# Altium project SolarTracker_ESP32.PrjPcb
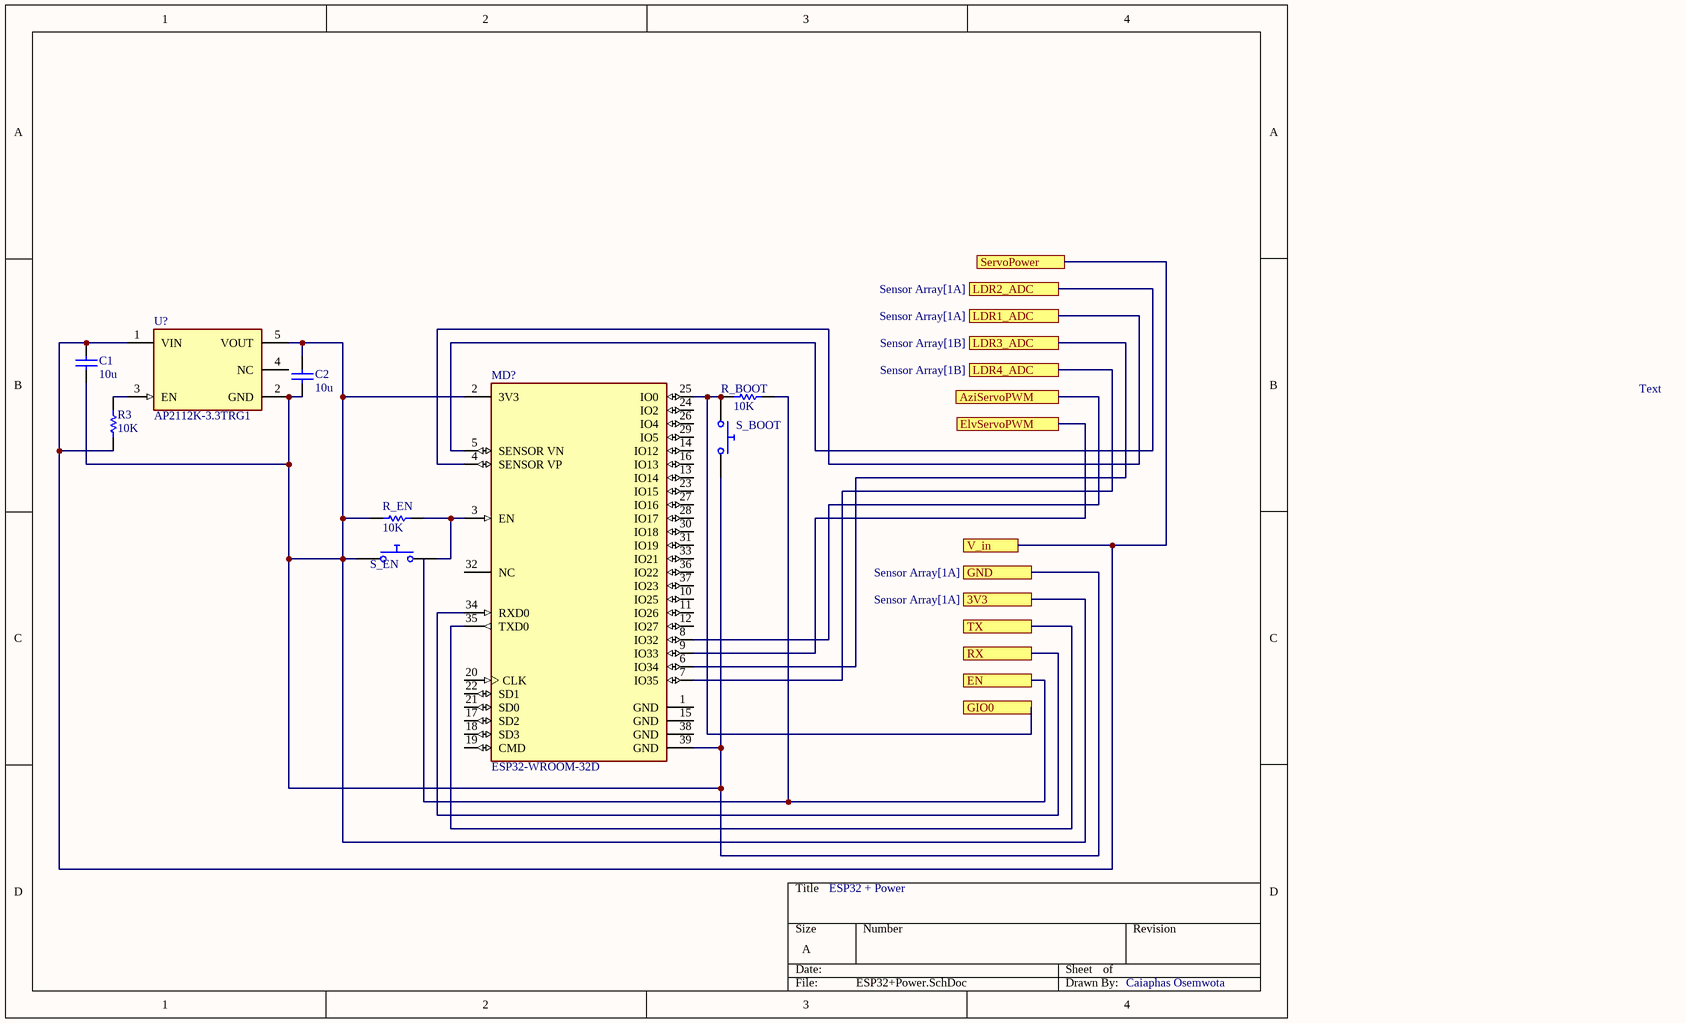
[diagram p0: ESP32+Power.SchDoc]
2 sheets, 21 parts. Net scope: flat (ports and power ports of the same name join across sheets).
Sheets:
  ESP32+Power.SchDoc
  Sensor Array.SchDoc

## Sheet ESP32+Power.SchDoc
size A; SheetNumber: 1; SheetTotal: 3

### Parts
(Parts that share a designator on the sheet are numbered #1, #2 ... from top to bottom, then left to right.)
C1#1  value 10u  (hidden comment: Capacitor)
C2#1  value 10u  (hidden comment: Capacitor)
MD?  ESP32-WROOM-32D  [FP-ESP32-WROOM-32D-MFG]
R3#1  value 10K  (hidden comment: Resistor)
R_BOOT  value 10K  (hidden comment: Resistor)
R_EN  value 10K  (hidden comment: Resistor)
S_BOOT  Push Button Normally Opened  (value not drawn)
S_EN  Push Button Normally Opened  (value not drawn)
U?  AP2112K-3.3TRG1  [FP-SOT25-IPC_A]

### Ports
3V3 (see Sensor Array[1A]), AziServoPWM, ElvServoPWM, EN, GIO0, GND (see Sensor Array[1A]), LDR1_ADC (see Sensor Array[1A]), LDR2_ADC (see Sensor Array[1A]), LDR3_ADC (see Sensor Array[1B]), LDR4_ADC (see Sensor Array[1B]), RX, ServoPower, TX, V_in

### Nets
NetC1#1_1: C1#1.1 C2#1.1 C2#1.2 MD?.2(3V3) MD?.39(GND) R_EN.1 S_BOOT.2 S_EN.1 U?.2(GND) U?.5(VOUT) ; port GND, port 3V3
NetC1#1_2: C1#1.2 R3#1.1 U?.1(VIN) ; port V_in, port ServoPower
NetC1#2_2: MD?.4(SENSOR_VP) ; port LDR1_ADC
NetC2#2_2: MD?.5(SENSOR_VN) ; port LDR2_ADC
NetC3_2: MD?.6(IO34) ; port LDR3_ADC
NetC4_2: MD?.7(IO35) ; port LDR4_ADC
NetMD?_3: MD?.3(EN) R_EN.2 S_EN.2
NetMD?_8: MD?.8(IO32) ; port AziServoPWM
NetMD?_9: MD?.9(IO33) ; port ElvServoPWM
NetMD?_25: MD?.25(IO0) R_BOOT.1 S_BOOT.1 ; port GIO0
NetMD?_34: MD?.34(RXD0) ; port RX
NetMD?_35: MD?.35(TXD0) ; port TX
NetR3#1_2: R3#1.2 U?.3(EN)
NetR_BOOT_2: R_BOOT.2 ; port EN

Not connected (* = marked no-connect by the designer): MD? 1(GND) 10(IO25) 11(IO26) 12(IO27) 13(IO14) 14(IO12) 15(GND) 16(IO13) 17(SD2) 18(SD3) 19(CMD) 20(CLK) 21(SD0) 22(SD1) 23(IO15) 24(IO2) 26(IO4) 27(IO16) 28(IO17) 29(IO5) 30(IO18) 31(IO19) 32(NC) 33(IO21) 36(IO22) 37(IO23) 38(GND); U? 4(NC)

### Notes on the sheet
- Text
- ESP32 + Power
- Caiaphas Osemwota

### Library data of the parts
C1#1 C2#1 = Capacitor: SimulationGenericComponent: True
MD? = CMP-194065-000003-1: WIFI MODULE 32MBITS SPI FLASH; Manufacturer: Espressif Systems; Max Supply Voltage: 3.6V; Nominal Supply Current: 500mA; Max Frequency: 2484MHz; Number Of Adc Channels: 16; Number Of Gpio: 32; Interface: I2C,SPI,UART,Ethernet,I2S,Other; Data Rate: 150Mbits/s; Min Supply Voltage: 3V; Bandwidth: 72MHz; Sensitivity: -98dBm; Octopart: https://octopart.com/esp32-wroom-32d-espressif+systems-91040050; Package: ESP32-WROOM-32D; ComponentLink2URL: https://www.espressif.com/sites/default/files/documentation/esp32-wroom-32d_esp32-wroom-32u_datasheet_en.pdf; Lead Free: Yes; Category: UNK; Mouser Description: Wi-Fi/BT BLE Module ESP32-D0WD, SPI Flash, UART, P; Device Class L1: Integrated Circuits (ICs); RoHS: TRUE; Temperature Range Low: -40°C; ComponentLink2Description: Datasheet; Digikey Description: WIFI MODULE 32MBITS SPI FLASH; Height: 3.2mm; Temperature: -40°C to +85°C; Manufacturer Part Number: ESP32-WROOM-32D; Device Class L3: Transceivers; Device Class L2: RF Semiconductors and Devices; Temperature Range High: +85°C; Automotive: No
R3#1 R_BOOT R_EN = Resistor: TC1: 0; SimulationGenericComponent: True; TC2: 0
S_BOOT S_EN = Push Button NO: closed: 0; Rclosed: 1m; Ropen: 1Meg; SimulationGenericComponent: True
U? = CMP-12756-000035-1: IC REG LINEAR 3.3V 600MA SOT25; Number of Regulators: 1; Output Type: Fixed; Polarity: Positive; Min Input Voltage: 2.5V; Max Input Voltage: 6V; Accuracy: 1.5%; Quiescent Current: 55uA; Dropout Voltage: 250mV; Min Operating Temperature: -40°C; Length: 3.1mm; Output Current: 600mA; Max Operating Temperature: 85°C; Package Quantity: 1; Output Voltage: 3.3V; Width: 1.7mm; Number of Outputs: 1; Packaging: Tape and Reel; Height: 1.3mm; Lead Free: Lead Free; Max Output Current: 600mA; Case/Package: SOT-23-5; Mount: Surface Mount; Number of Pins: 5

## Sheet Sensor Array.SchDoc
size A; SheetNumber: 2; SheetTotal: 3
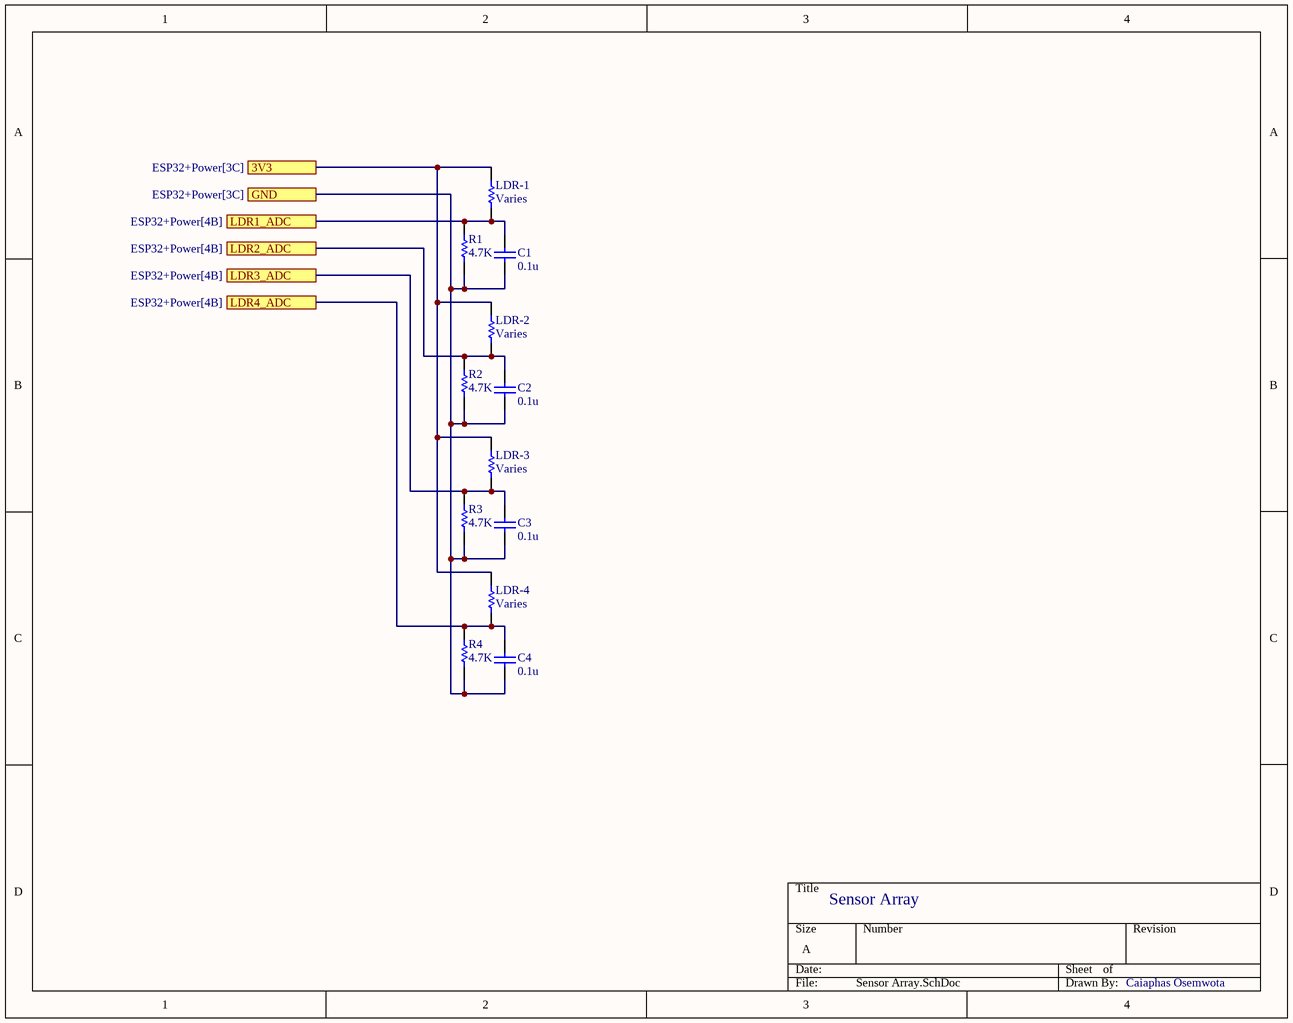
[diagram p1: Sensor Array.SchDoc]

### Parts
(Parts that share a designator on the sheet are numbered #1, #2 ... from top to bottom, then left to right.)
C1#2  value 0.1u  (hidden comment: Capacitor)
C2#2  value 0.1u  (hidden comment: Capacitor)
C3  value 0.1u  (hidden comment: Capacitor)
C4  value 0.1u  (hidden comment: Capacitor)
LDR-1  value Varies  (hidden comment: Resistor)
LDR-2  value Varies  (hidden comment: Resistor)
LDR-3  value Varies  (hidden comment: Resistor)
LDR-4  value Varies  (hidden comment: Resistor)
R1  value 4.7K  (hidden comment: Resistor)
R2  value 4.7K  (hidden comment: Resistor)
R3#2  value 4.7K  (hidden comment: Resistor)
R4  value 4.7K  (hidden comment: Resistor)

### Ports
3V3 (see ESP32+Power[3C]), GND (see ESP32+Power[3C]), LDR1_ADC (see ESP32+Power[4B]), LDR2_ADC (see ESP32+Power[4B]), LDR3_ADC (see ESP32+Power[4B]), LDR4_ADC (see ESP32+Power[4B])

### Nets
NetC1#1_1: C1#2.1 C2#2.1 C3.1 C4.1 LDR-1.2 LDR-2.2 LDR-3.2 LDR-4.2 R1.1 R2.1 R3#2.1 R4.1 ; port GND, port 3V3
NetC1#2_2: C1#2.2 LDR-1.1 R1.2 ; port LDR1_ADC
NetC2#2_2: C2#2.2 LDR-2.1 R2.2 ; port LDR2_ADC
NetC3_2: C3.2 LDR-3.1 R3#2.2 ; port LDR3_ADC
NetC4_2: C4.2 LDR-4.1 R4.2 ; port LDR4_ADC

### Notes on the sheet
- Sensor Array
- Caiaphas Osemwota

### Library data of the parts
C1#2 C2#2 C3 C4 = Capacitor: SimulationGenericComponent: True
LDR-1-LDR-4 R1 R2 R3#2 R4 = Resistor: TC1: 0; SimulationGenericComponent: True; TC2: 0

## Nets that join several sheets
NetC1#1_1: ESP32+Power (10 pins), Sensor Array (12 pins)
NetC1#2_2: ESP32+Power (MD?.4), Sensor Array (C1#2.2 LDR-1.1 R1.2)
NetC2#2_2: ESP32+Power (MD?.5), Sensor Array (C2#2.2 LDR-2.1 R2.2)
NetC3_2: ESP32+Power (MD?.6), Sensor Array (C3.2 LDR-3.1 R3#2.2)
NetC4_2: ESP32+Power (MD?.7), Sensor Array (C4.2 LDR-4.1 R4.2)